# Altium schematic sheet 16-TemHumdIr.SchDoc
size A
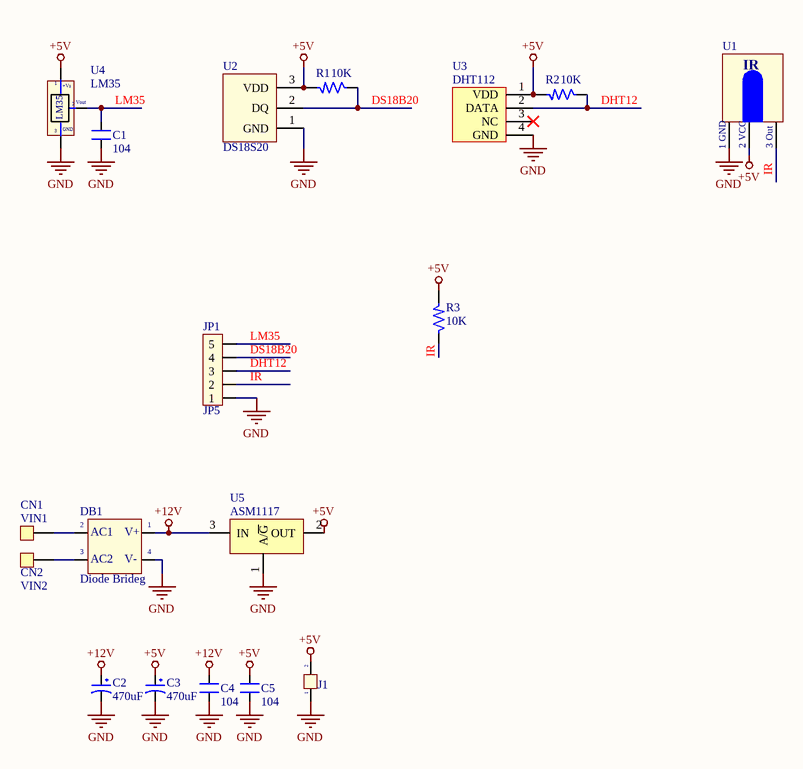
[diagram p0: 16-TemHumdIr.SchDoc]

## Parts
C1  104  [C-0805]
C2  470uF  [C-ALU-D6.5]
C3  470uF  [C-ALU-D6.5]
C4  104  [C-0805]
C5  104  [C-0805]
CN1  VIN1  [M3]
CN2  VIN2  [M3]
DB1  Diode Brideg  [D-DB-1A-SMD]
J1  Jumper 2  [JP2]  (value not drawn)
JP1  JP5  [JP5]
R1  10K  [R-0805]
R2  10K  [R-0805]
R3  10K  [R-0805]
U1  IR1  [IR-TSOP1133]  (value not drawn)
U2  DS18S20  [TO-92AB]
U3  DHT112  [DHT12]
U4  LM35  [QTO-92]
U5  ASM1117  [TO-252]

## Nets
+5V: C3.1 C5.2 J1.2 R1.2 R2.2 R3.2 U1.2(GND) U2.3(VDD) U3.1(VDD) U4.1(+Vs) U5.2(OUT)
+12V: C2.1 C4.2 DB1.3(AC2) U5.3(IN)
GND: C1.1 C2.2 C3.2 C4.1 C5.1 DB1.4(-V_OUT) J1.1 JP1.1 U1.1(Out) U2.1(GND) U3.4(GND) U4.3(-) U5.1(A/~{G})
DHT12: JP1.3 R2.1 U3.2(DATA)
DS18B20: JP1.4 R1.1 U2.2(DQ)
IR: JP1.2 R3.1 U1.3(VCC)
LM35: C1.2 JP1.5 U4.2(Vout)
NetCN1_1: CN1.1 DB1.2(AC1)
NetCN2_1: CN2.1 DB1.1(+V_OUT)

Not connected (* = marked no-connect by the designer): U3 3(NC)*

## Notes on the sheet
- (in symbol DB) V+; V-
- (in symbol IR1) IR; 1 GND; 2 VCC; 3 Out
- (in symbol LM35) GND

## Library data of the parts
C1 C4 C5 = CN: Value: 0,1uF/300V; Designed by: VanDungEvn
C2 C3 = CP1: Cap P  0,1uF < 22uF , 16 - 50V; Value: 10uF/50V; Description 1: 10 => 220uF/6,3V/10V - 10uF => 100uF/16V; Description 2: 0,1uF => 33uF/50V - 10uF => 22uF/63V; Description 3: 0,47uF => 10uF/100V
CN1 CN2 = COCDONGM3: Value: M3
DB1 = DB: Convert AC to DC voltage, 4 pin; Value: Cau 1A
J1 = JP 2: Value: JP 2
R1-R3 = R: Resistor 1/4W; Value: R1/4W - 1K
U1 = IR1: Receiver Infraed IC
U2 = DS18S20: High Precision  1-Wire® Digital Thermometer
U3 = DHT11: Value: DHT11
U4 = LM35: Teminal; Value: LM35